# EAGLE design schematic (EAGLE 8.3.1)
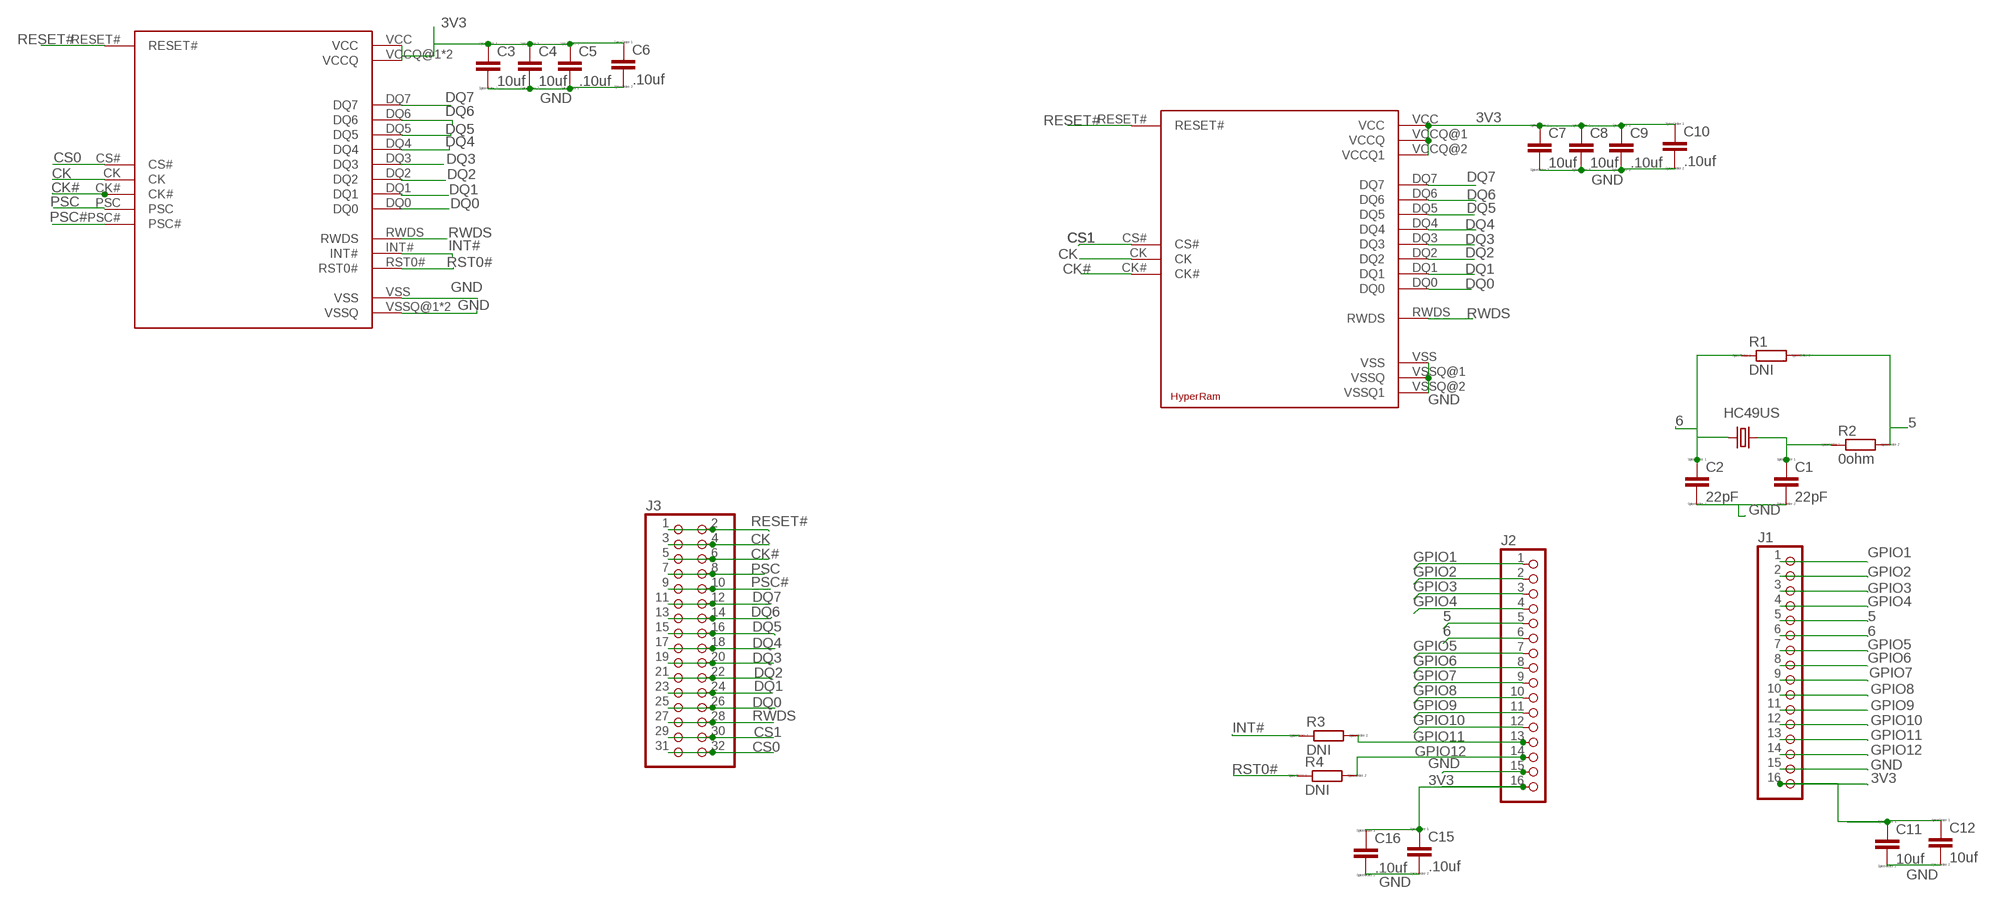
[diagram p0: schematic, sheet 1]

## Parts
C1  22pF  CC0603  [C0603]
C2  22pF  CC0603  [C0603]
C3  10uf  CC0402  [C0402]
C4  10uf  CC0402  [C0402]
C5  .10uf  CC0402  [C0402]
C6  .10uf  CC0402  [C0402]
C7  10uf  CC0402  [C0402]
C8  10uf  CC0402  [C0402]
C9  .10uf  CC0402  [C0402]
C10  .10uf  CC0402  [C0402]
C11  10uf  CC0402  [C0402]
C12  10uf  CC0402  [C0402]
C15  .10uf  CC0402  [C0402]
C16  .10uf  CC0402  [C0402]
HC49US  12 Mhz  MODIFIEDSMD  [HC49UP]
J1  PINHD-1X16  [1X16]
J2  PINHD-1X16  [1X16]
J3  PINHD-2X16  [2X16]
R1  DNI  RR0603  [R0603]
R2  0ohm  RR0603  [R0603]
R3  DNI  RR0603  [R0603]
R4  DNI  RR0603  [R0603]
U$1  HYPERFLASH_MEMORY  [BGA-24]
U$2  HYPERFLASH_MEMORY  [BGA-24_RAM]

## Nets
3V3: C3.1 C4.1 C5.1 C6.1 C7.1 C8.1 C9.1 C10.1 C11.1 C12.1 C15.1 C16.1 J1.16 J2.16 U$1.VCC U$1.VCCQ@1(VCCQ) U$1.VCCQ@2(VCCQ) U$2.VCC U$2.VCCQ@1(VCCQ) U$2.VCCQ@2(VCCQ1)
5: J1.5 J2.5 R1.2 R2.2
6: C2.1 HC49US.1 HC49US.P$1 J1.6 J2.6 R1.1
CK: J3.3 J3.4 U$1.CK U$2.CK
CK#: J3.5 J3.6 U$1.CK# U$2.CK#
CS0: J3.31 J3.32 U$1.CS#
CS1: J3.29 J3.30 U$2.CS#
DQ0: J3.25 J3.26 U$1.DQ0 U$2.DQ0
DQ1: J3.23 J3.24 U$1.DQ1 U$2.DQ1
DQ2: J3.21 J3.22 U$1.DQ2 U$2.DQ2
DQ3: J3.19 J3.20 U$1.DQ3 U$2.DQ3
DQ4: J3.17 J3.18 U$1.DQ4 U$2.DQ4
DQ5: J3.15 J3.16 U$1.DQ5 U$2.DQ5
DQ6: J3.13 J3.14 U$1.DQ6 U$2.DQ6
DQ7: J3.11 J3.12 U$1.DQ7 U$2.DQ7
GND: C1.2 C2.2 C3.2 C4.2 C5.2 C6.2 C7.2 C8.2 C9.2 C10.2 C11.2 C12.2 C15.2 C16.2 J1.15 J2.15 U$1.VSS U$1.VSSQ@1(VSSQ) U$1.VSSQ@2(VSSQ) U$2.VSS U$2.VSSQ@1(VSSQ) U$2.VSSQ@2(VSSQ1)
GPIO1: J1.1 J2.1
GPIO2: J1.2 J2.2
GPIO3: J1.3 J2.3
GPIO4: J1.4 J2.4
GPIO5: J1.7 J2.7
GPIO6: J1.8 J2.8
GPIO7: J1.9 J2.9
GPIO8: J1.10 J2.10
GPIO9: J1.11 J2.11
GPIO10: J1.12 J2.12
GPIO11: J1.13 J2.13 R3.2
GPIO12: J1.14 J2.14 R4.2
INT#: R3.1 U$1.INT#
N$7: C1.1 HC49US.2 HC49US.P$2 R2.1
PSC: J3.7 J3.8 U$1.PSC
PSC#: J3.9 J3.10 U$1.PSC#
RESET#: J3.1 J3.2 U$1.RESET# U$2.RESET#
RST0#: R4.1 U$1.RST0#
RWDS: J3.27 J3.28 U$1.RWDS U$2.RWDS

## Library data of the parts
C1-C12 C15 C16 = eagle-ltspice:C: CAPACITOR, European symbol; SPICEMODEL: NONE; SPICEPREFIX: C
HC49US = modifiedsmd:MODIFIEDSMD
J1 J2 = pinhead:PINHD-1X16: PIN HEADER
J3 = pinhead:PINHD-2X16: PIN HEADER
R1-R4 = eagle-ltspice:R: RESISTOR, European symbol; SPICEMODEL: NONE; SPICEPREFIX: R
U$1 = hyperflash:HYPERFLASH_MEMORY
U$2 = hyper_ram:HYPERFLASH_MEMORY

## Board
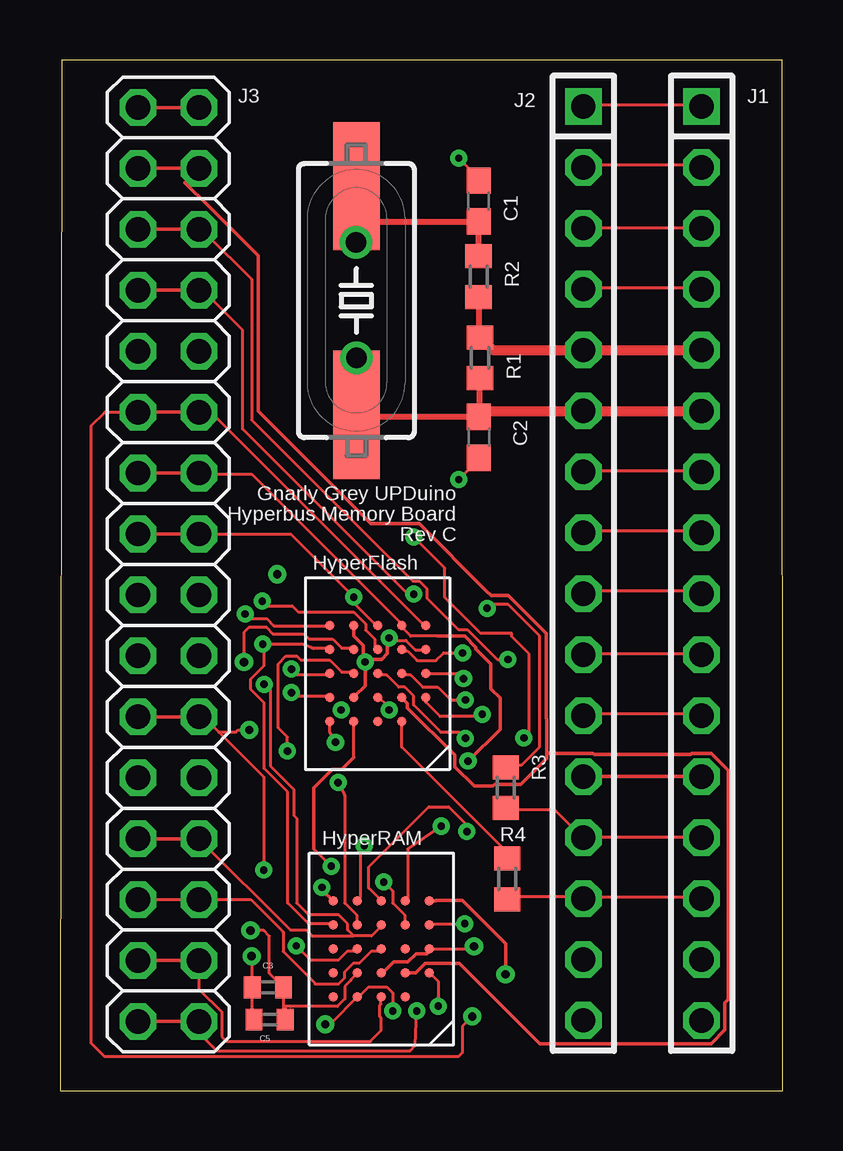
[diagram p1: board, top side]
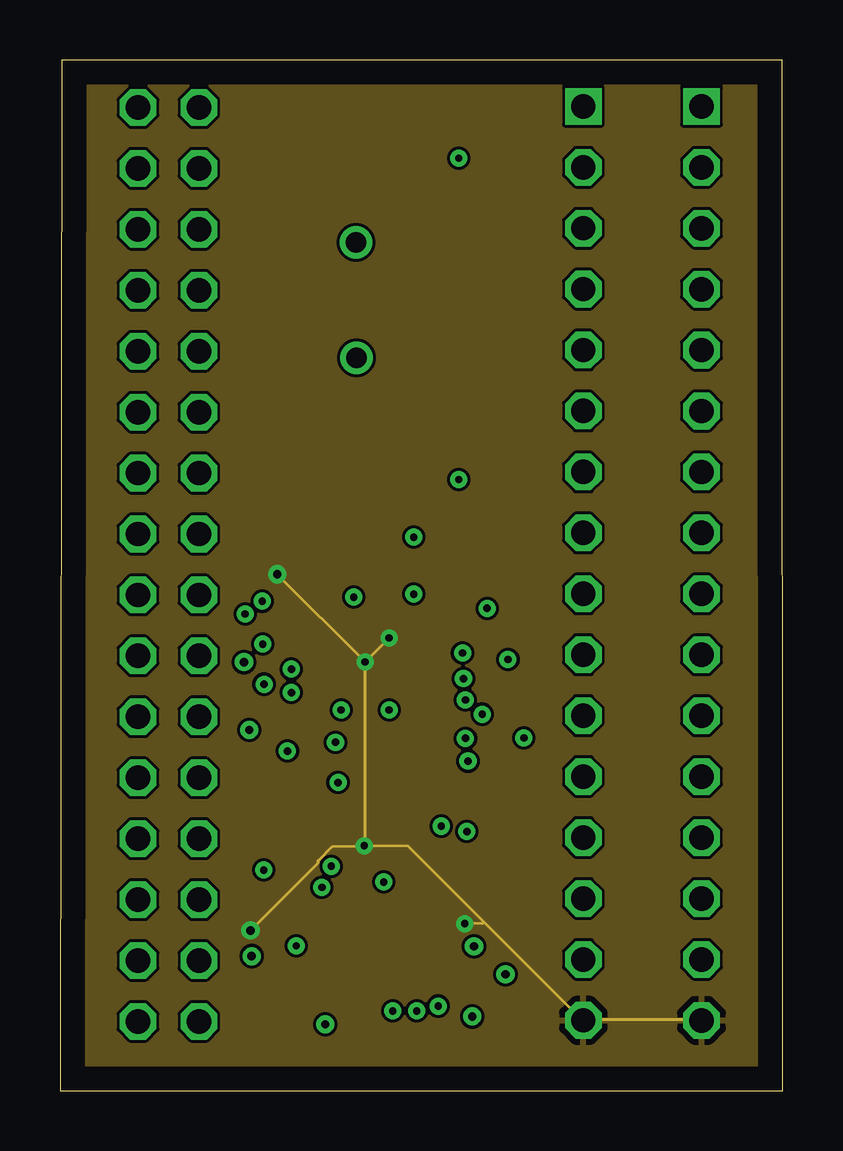
[diagram p2: board, inner layer 3V3]
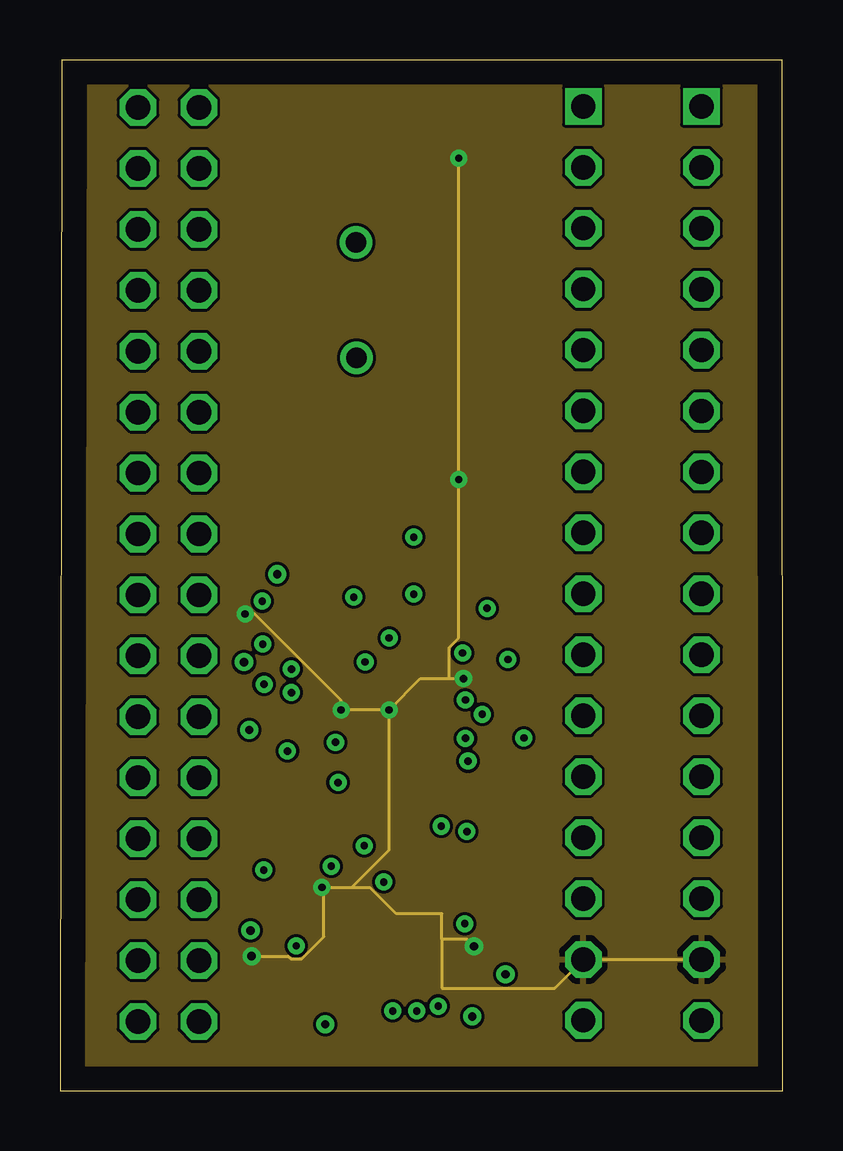
[diagram p3: board, inner layer GND]
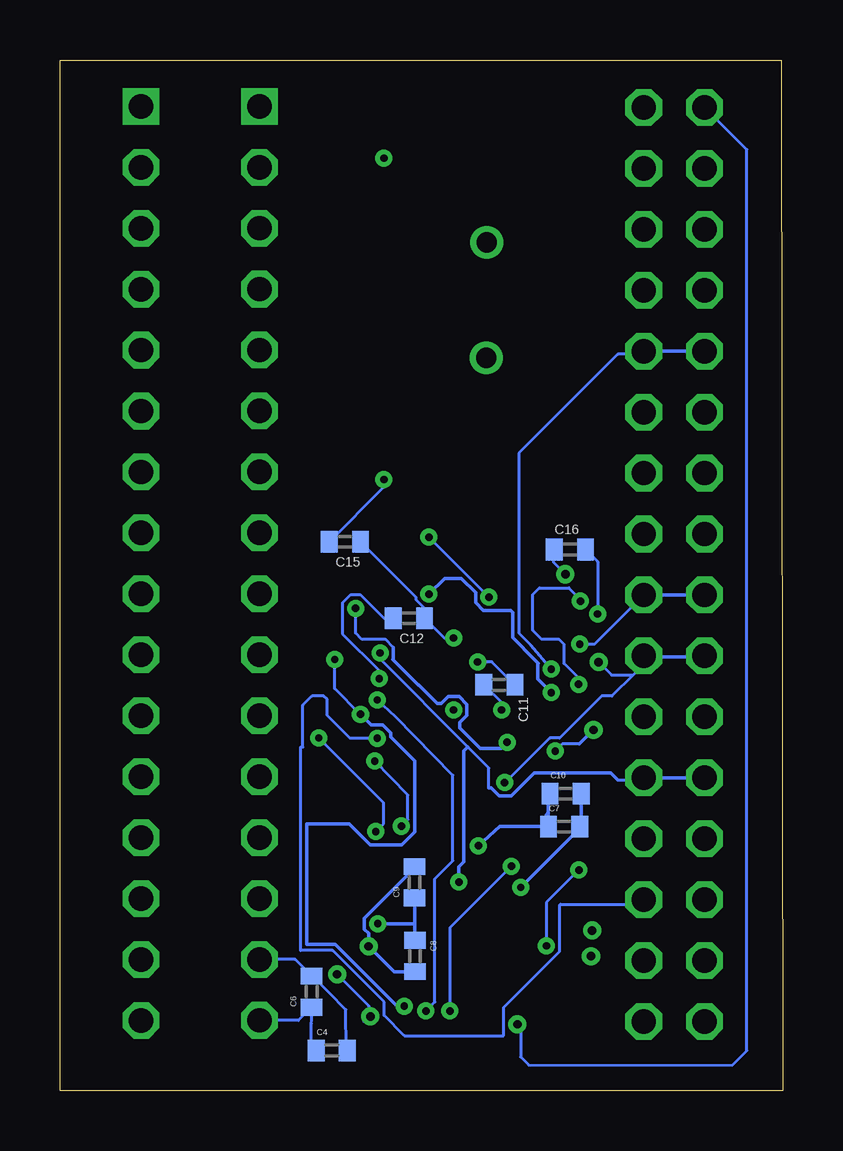
[diagram p4: board, bottom side, seen from below]

Size 30.11 x 42.98 mm. Coordinates in mm from the lower left corner, seen from the top.
Outline: 0,0 30.11,0 30.09,42.97 0.06,42.98 0,0
Copper layers (1*2+15*16): Top 0.035mm / dielectric 1.5mm / 3V3 0.035mm / dielectric 0.15mm / GND 0.035mm / dielectric 0.2mm / Bottom 0.035mm
Design rules "default *": minimum track width 5mil, minimum drill 12mil, track to track 5mil, track to pad 5mil, pad to pad 5mil, via to via 5mil, smd to smd 5mil, copper to edge 40mil, drill to drill 6mil, minimum pad ring 10mil, minimum via ring 8mil, stop-mask expansion 4mil, vias tented up to drill 0mil, thermal gap 10mil

### Footprints (pad centres in the part's own frame; a part is rotated, then mirrored left to right if it is on the bottom)
C0603 = smd 1.1 x 1: 1 -0.85,0; 2 0.85,0
C0402 = smd 0.7 x 0.9: 1 -0.65,0; 2 0.65,0
HC49UP = smd 5.334 x 1.93: 1 -4.763,0; 2 4.763,0 | drill 0.85: P$1 -2.393,-0.001; P$2 2.426,0.022
1X16 = drill 1.016 square: 1 -19.05,0 | drill 1.016 octagon: 2 -16.51,0; 3 -13.97,0; 4 -11.43,0; 5 -8.89,0; 6 -6.35,0; 7 -3.81,0; 8 -1.27,0; 9 1.27,0; 10 3.81,0; 11 6.35,0; 12 8.89,0; 13 11.43,0; 14 13.97,0; 15 16.51,0; 16 19.05,0
2X16 = drill 1.016 octagon: 1 -19.05,-1.27; 2 -19.05,1.27; 3 -16.51,-1.27; 4 -16.51,1.27; 5 -13.97,-1.27; 6 -13.97,1.27; 7 -11.43,-1.27; 8 -11.43,1.27; 9 -8.89,-1.27; 10 -8.89,1.27; 11 -6.35,-1.27; 12 -6.35,1.27; 13 -3.81,-1.27; 14 -3.81,1.27; 15 -1.27,-1.27; 16 -1.27,1.27; 17 1.27,-1.27; 18 1.27,1.27; 19 3.81,-1.27; 20 3.81,1.27; 21 6.35,-1.27; 22 6.35,1.27; 23 8.89,-1.27; 24 8.89,1.27; 25 11.43,-1.27; 26 11.43,1.27; 27 13.97,-1.27; 28 13.97,1.27; 29 16.51,-1.27; 30 16.51,1.27; 31 19.05,-1.27; 32 19.05,1.27
R0603 = smd 1 x 1.1: 1 -0.85,0; 2 0.85,0
BGA-24 = smd 0.4 x 0.4: CK -1.07,1.016; CK# -2.07,1.016; CS# -1.07,0.016; DNU -0.07,2.016; DQ0 -0.07,-0.984; DQ1 -1.07,-0.984; DQ2 0.93,0.016; DQ3 0.93,-0.984; DQ4 1.93,-0.984; DQ5 -0.07,-1.984; DQ6 -1.07,-1.984; DQ7 -2.07,-1.984; INT# 1.93,2.016; PSC 1.93,1.016; PSC# 1.93,0.016; RESET# 0.93,2.016; RST0# -1.07,2.016; RWDS -0.07,0.016; VCC 0.93,1.016; VCCQ@1 -2.07,-0.984; VCCQ@2 0.93,-1.984; VSS -0.07,1.016; VSSQ@1 -2.07,0.016; VSSQ@2 1.93,-1.984
BGA-24_RAM = smd 0.4 x 0.4: CK -1.07,1.016; CK# -2.07,1.016; CS# -0.07,2.016; DQ0 -0.07,-0.984; DQ1 -1.07,-0.984; DQ2 0.93,0.016; DQ3 0.93,-0.984; DQ4 1.93,-0.984; DQ5 -0.07,-1.984; DQ6 -1.07,-1.984; DQ7 -2.07,-1.984; RESET# 0.93,2.016; RFU@1 -1.07,2.016; RFU@2 -1.07,0.016; RFU@3 1.93,2.016; RFU@4 1.93,1.016; RFU@5 1.93,0.016; RWDS -0.07,0.016; VCC 0.93,1.016; VCCQ@1 -2.07,-0.984; VCCQ@2 0.93,-1.984; VSS -0.07,1.016; VSSQ@1 -2.07,0.016; VSSQ@2 1.93,-1.984

### Placement (x,y rotation side)
C1  17.45,37.1 90 top
C2  17.44,27.25 270 top
C3  8.66,4.32 180 top
C4  18.79,1.69 0 bottom
C5  8.73,2.98 180 top
C6  19.63,4.14 90 bottom
C7  9.11,11.02 0 bottom
C8  15.32,5.62 270 bottom
C9  15.34,8.7 90 bottom
C10  9.04,12.4 0 bottom
C11  11.8,16.93 180 bottom
C12  15.57,19.7 180 bottom
C15  18.24,22.89 180 bottom
C16  8.86,22.57 0 bottom
HC49US  12.35,32.95 90 top
J1  26.73,21.99 270 top
J2  21.8,21.99 270 top
J3  4.52,21.95 270 top
R1  17.5,30.56 90 top
R2  17.44,33.95 270 top
R3  18.57,12.64 270 top
R4  18.63,8.84 270 top
U$1  13.16,17.41 180 top
U$2  13.32,5.93 180 top

### Tracks (layer width: path | path; a pad name or v marks a point on that pad's centre or on a via)
3V3  (via drill 0.3, 0.35)
  Top 0.127: U$2.VCCQ@2 12.41,7.99 12.51,8.09 12.51,10.06 v12.68,10.22 | U$1.VCC 12.31,16.49 | U$1.VCCQ@2 12.31,19.39 U$1.VCCQ@2 | v13.71,18.89 13.81,18.79 14.41,18.79 14.81,18.39 15.21,18.39 U$1.VCCQ@1 | v16.87,6.97 15.43,6.96 15.43,6.95 U$2.VCCQ@1 | U$2.VCC 12.12,4.64 12.12,4.61 11.87,4.36 11.87,3.84 11.56,3.53 9.62,3.53 | 9.62,3.53 9.61,3.52 | 9.62,3.53 9.38,3.53 C5.1 9.31,2.98 C3.1 8.73,4.91 8.73,6.45 8.49,6.69 v7.94,6.69
  Top 0.15: 12.61,10.16 v12.68,10.22 | 12.31,16.49 12.71,16.89 12.71,17.81 | 12.71,17.81 v12.71,17.89 | v13.71,18.89 13.63,18.81 13.63,18.23 13.4,17.99 12.89,17.99 12.78,17.88 | 12.78,17.88 12.71,17.81 | U$1.VCCQ@2 12.23,18.96 12.63,18.56 12.63,18.03 12.78,17.88
  3V3 0.127: v12.68,10.22 14.51,10.19 17.61,7.09 | 17.61,7.09 21.71,2.99 J2.16 21.81,2.99 26.71,2.99 J1.16 | 12.71,16.89 v12.71,17.89 | v12.71,17.89 v13.71,18.89 | v16.87,6.97 17.61,6.99 17.61,7.09 | v7.94,6.69 10.76,9.51 10.76,9.59 11.35,10.19 v12.68,10.22 | v12.68,10.22 12.71,10.26 v12.71,17.89 | v12.71,17.89 v9.06,21.54 v9.05,21.54
  Bottom 0.127: C4.1 19.63,1.53 19.63,2.81 19.63,2.93 C6.1 20.17,2.94 J2.16 | C11.1 12.11,17.89 v12.71,17.89 | C12.1 | C12.1 14.11,18.89 v13.71,18.89 | C15.1 15.28,20.58 15.28,20.48 14.92,20.12 C12.1 | v9.05,21.54 9.54,22.02 C16.1
  Bottom 0.15: C8.1 15.32,8.03 C9.1 15.34,6.97 v16.87,6.97 | 9.76,11.6 C7.1 11.78,11.02 v12.68,10.22 | 9.76,11.6 9.76,12.33 C10.1 | 9.85,11.51 9.76,11.6
  pour 3V3: 0.51,42.49 29.51,42.49 29.44,0.2 0.63,0.16
5
  Top 0.2: 17.44,31.66 17.44,31.47 R1.2
  Top 0.254: 17.44,32.72 17.44,31.66
  Top 0.305: R2.2 17.44,32.72
  Top 0.406: R1.2 18.03,30.88 J2.5 J1.5
6
  Top 0.254: R1.1 17.5,28.15 C2.1 12.98,28.1 HC49US.1 12.93,30.42 HC49US.P$1
  Top 0.406: C2.1 17.69,28.34 J2.6 J1.6
CK
  Top 0.152: J3.3 J3.4 5.2,37.87 6.19,36.88 8.25,34.82 8.25,28.34 12.95,23.64 14.97,23.64 17.76,20.85 17.97,20.65 18.68,20.65 20.25,19.07 20.25,15.52 20.29,15.49 20.29,14.08 | 20.29,14.08 20.29,13.87 19.21,12.79 18.11,12.79 18.03,12.71 17.25,12.71 16.44,13.52 16.44,14.01 14.47,15.98 14.47,16.15 U$1.CK | U$2.CK 14.83,4.92 15.23,5.32 16.64,5.32 19.98,1.98 27.13,1.98 27.7,2.54 27.7,3.68 27.84,3.82 27.84,13.35 27.13,14.07 26.33,14.07 26.28,14.02 22.26,14.02 22.2,14.07 20.3,14.07 20.29,14.08
CK#  (via drill 0.3)
  Top 0.127: 5.99,35.84 6.12,35.7 7.99,33.84 7.99,27.97 14.71,21.26 14.96,21.26 15.28,20.94 15.28,20.54 16.6,19.23 16.97,19.23 18.21,17.99 v18.67,17.99 | U$1.CK# 15.24,16.34 15.24,16.21 15.84,15.61 17.5,15.61 v17.59,15.7 | U$2.CK# 15.49,4.84 15.76,4.56 v15.76,3.54
  Top 0.152: J3.5 J3.6 5.91,35.92 6.12,35.7
  Bottom 0.127: v17.59,15.7 18.67,16.78 v18.67,17.99
  Bottom 0.15: 17.85,5.33 18.64,6.12 19.82,6.12 19.82,11.14 18.07,11.14 17.94,11.01 17.51,10.58 17.18,10.26 15.88,10.26 15.33,10.81 15.33,11.54 15.32,11.55
  Bottom 0.152: v15.76,3.54 16.06,3.54 17.85,5.33 | 15.33,10.81 15.33,11.16 15.32,11.16 15.32,11.55 15.32,13.75 16.34,14.77 16.34,14.93 16.66,15.26 17.15,15.26 v17.59,15.7
CS0  (via drill 0.3)
  Top 0.127: v14.86,3.34 14.81,1.9 14.59,1.68 6.53,1.68 5.79,2.43 J3.32 | U$1.CS# 14.24,17.34 14.61,17.34 15.11,16.84 15.74,16.84 16.28,16.3 v16.89,16.3
  Top 0.152: J3.31 J3.32 5.97,2.71
  Bottom 0.127: v16.89,16.3 16.11,15.59 13.74,13.16 13.74,9.59 14.49,8.84 14.49,3.71 v14.86,3.34
CS1
  Top 0.127: 13.37,3.85 13.36,3.84 | 13.37,3.85 U$2.CS# | J3.30 5.79,4.24 6.74,3.29 6.74,2.26 6.94,2.06 12.93,2.06 13.38,2.52 13.38,3.04 13.32,3.11 13.32,3.56 13.37,3.62 13.37,3.85
  Top 0.152: J3.29 J3.30 5.89,5.34 5.99,5.34
DQ0  (via drill 0.3)
  Top 0.127: 12.24,6.46 11.99,6.71 11.99,6.96 11.61,7.34 10.36,7.34 9.86,7.84 9.86,11.36 9.74,11.48 9.74,12.57 8.82,13.49 8.76,13.54 8.76,16.69 v8.5,16.95 | 12.24,6.46 12.99,6.46 13.36,6.84 U$2.DQ0 | U$1.DQ0 13.11,18.46 13.11,18.84 12.74,19.21 12.74,19.46 12.24,19.96 9.93,19.96 9.67,20.22 8.62,20.22 v8.43,20.41 | 6.03,10.42 5.99,10.46 | J3.26 9.6,6.71 10.26,6.71 10.5,6.46 12.24,6.46
  Top 0.152: J3.25 J3.26 5.88,10.42 6.03,10.42
  Bottom 0.127: v8.5,16.95 8.5,17.21 9.1,17.81 9.1,18.62 9.31,18.83 10.04,18.83 10.4,19.19 10.4,20.7 10.13,20.97 8.9,20.97 8.43,20.49 v8.43,20.41
DQ1  (via drill 0.3)
  Top 0.127: v13.49,8.71 13.86,8.34 13.86,7.84 14.36,7.34 14.36,6.96 U$2.DQ1 | U$1.DQ1 14.24,18.34 14.49,18.34 14.88,17.94 15.67,17.94 15.98,18.26 v16.77,18.26
  Bottom 0.127: 6.86,12.96 5.99,12.96 | 12.24,12.63 12.24,13.46 13.12,14.35 16.77,18 v16.77,18.26
  Bottom 0.15: 12.24,12.63 12.15,12.63 11.82,12.3 11.31,12.3 10.35,13.26 7.16,13.26 6.86,12.96 | v13.49,8.71 13.49,9.34 13.29,9.54 13.29,14.18 13.12,14.35
  Bottom 0.152: J3.23 J3.24 5.88,12.96 5.99,12.96
DQ2  (via drill 0.3, 0.35)
  Top 0.127: v8.49,9.21 8.49,13.09 6.61,14.96 | 6.61,14.96 5.99,15.59 | U$2.DQ2 12.36,5.84 11.99,5.84 11.61,5.46 10.43,5.46 v9.84,6.04 | U$1.DQ2 12.11,17.46 11.74,17.46 11.24,17.96 10.04,17.96 9.87,18.13 9.42,18.13 9.1,17.81 9.1,15.14 9.48,14.76 v9.48,14.17 | 6.61,14.96 7.33,14.96 7.42,15.05 7.86,15.05
  Top 0.152: J3.21 J3.22 5.99,15.59 | 7.86,15.05 v7.88,15.05
  Bottom 0.127: v8.49,9.21 9.84,7.86 v9.84,6.04 | 8.47,14.46 9.18,14.46 v9.48,14.17
  Bottom 0.152: J3.22 | v7.88,15.05 8.47,14.46
DQ3  (via drill 0.3, 0.35)
  Top 0.127: v11.59,12.86 11.86,12.31 11.86,7.84 12.36,7.34 12.36,6.96 U$2.DQ3 | U$1.DQ3 12.11,18.46 11.74,18.46 11.36,18.84 10.39,18.84 10.17,19.06 8.87,19.06 8.59,19.33 7.88,19.33 7.68,19.13 7.68,17.88 v7.67,17.88
  Bottom 0.127: 5.49,18.09 6.23,17.34 | v7.67,17.88 7.13,17.34 6.23,17.34 | v11.59,12.86 11.43,12.99 9.7,14.71 9.29,14.71 7.55,16.46 7.12,16.46 6.23,17.34
  Bottom 0.152: J3.19 3.3,18.09 5.49,18.09 5.74,18.09 J3.20
DQ4  (via drill 0.3)
  Top 0.127: 11.11,18.34 U$1.DQ4 11.19,18.44 10.56,18.44 10.51,18.46 10.05,18.63 8.51,18.63 | U$2.DQ4 11.36,6.96 10.36,6.96 9.49,7.84 9.49,12.46 8.51,13.44 8.51,16.17 7.96,16.73 7.96,17.18 8.51,17.73 8.51,18.63 | 8.51,18.63 v8.45,18.63
  Bottom 0.127: 8.45,18.64 v8.45,18.63 8.44,18.64 7.83,18.64 J3.18
  Bottom 0.152: J3.17 J3.18 5.9,20.68 5.99,20.59
DQ5  (via drill 0.3)
  Top 0.127: U$2.DQ5 13.36,7.96 12.86,8.46 12.86,9.34 15.37,11.84 16.2,11.84 16.95,11.09 v16.95,10.81 | U$1.DQ5 13.11,19.46 12.24,20.34 v12.24,20.59 9.61,23.21 5.99,23.21 | v14.74,23.09 16.03,21.79 16.03,20.57 17.53,19.08 18.81,19.08 18.81,18.94 19.54,18.21 19.54,14.93 v19.33,14.71
  Top 0.152: J3.15 J3.16 5.98,23.22 5.99,23.21
  Bottom 0.127: v19.33,14.71 16.63,12.01 16.63,11.14 v16.95,10.81 | v12.24,20.59 v14.74,23.09
DQ6  (via drill 0.3)
  Top 0.127: v15.89,11.04 14.49,10.09 14.49,7.96 U$2.DQ6 | 15.74,18.96 14.61,18.96 14.24,19.34 U$1.DQ6 14.24,19.46 7.99,25.71 6.07,25.71 5.99,25.71
  Top 0.15: v17,13.75 v17.01,13.75 18.34,15.08 18.34,16.38 17.96,16.76 17.96,17.8 17.33,18.42 17.33,18.49 16.86,18.96 15.74,18.96
  Top 0.152: J3.13 J3.14 6.03,25.76 6.07,25.71
  Bottom 0.127: v17,13.75 15.61,12.34 15.61,11.31 v15.89,11.04
DQ7  (via drill 0.35)
  Top 0.127: 5.99,28.21 6.36,28.21 15.11,19.46 U$1.DQ7 | 18.59,4.87 18.57,4.86 v18.56,4.86 | v17.18,3.11 16.77,2.69 16.77,1.6 16.59,1.42 1.86,1.42 1.31,1.98 1.31,27.74 1.86,28.29
  Top 0.152: 3.33,28.3 J3.11 | 3.33,28.3 J3.12 5.9,28.3 5.99,28.21 | 1.86,28.29 3.33,28.3 | U$2.DQ7 15.65,7.92 15.68,7.94 16.75,7.94 18.56,6.13 v18.56,4.86
  Bottom 0.127: 17.25,3.11 17.45,2.9 | 17.25,3.11 v17.18,3.11 | 17.25,3.11 17.25,3.54 v18.56,4.86
GND  (via drill 0.3, 0.35)
  Top 0.127: U$2.VSS 13.41,4.89 | 10.91,8.39 v10.91,8.49 | v13.71,15.89 13.61,15.99 13.61,16.09 13.31,16.39 U$1.VSS | v16.81,17.19 16.61,17.39 15.31,17.39 U$1.VSSQ@1 | v7.71,19.89 7.91,19.69 8.61,19.69 8.91,19.39 11.21,19.39 U$1.VSSQ@2 | v16.61,25.49 17.41,26.29 17.41,26.39 C2.2 | v16.61,38.89 17.41,38.09 17.41,37.99 C1.2 | U$2.VSSQ@1 15.47,5.92 16.86,5.92 16.88,5.94 17.16,5.94 v17.25,6.03 | C5.2 8.01,2.98 C3.2 8.01,5.71 7.99,5.71 v7.99,5.62
  Top 0.15: 13.41,4.89 13.91,5.38 14.5,5.38 14.84,5.72 15.28,5.72 15.47,5.92
  Top 0.152: U$2.VSSQ@2 11.38,7.92 10.91,8.39
  GND 0.127: 15.91,6.33 15.91,7.39 14.01,7.39 12.91,8.49 12.16,8.49 | 15.91,6.33 15.91,4.29 20.61,4.29 21.71,5.39 J2.15 26.71,5.49 J1.15 | v13.71,15.89 v11.71,15.89 11.71,16.29 8.11,19.89 v7.71,19.89 | 10.99,8.49 v10.91,8.49 | 10.99,8.49 12.16,8.49 | 16.21,17.19 15.01,17.19 v13.71,15.89 | 16.21,17.19 v16.81,17.19 | 16.21,17.19 16.21,18.49 16.61,18.89 v16.61,25.49 v16.61,38.89 | v17.25,6.03 16.95,6.33 15.91,6.33 | v7.99,5.62 9.5,5.62 9.62,5.5 10.07,5.5 10.99,6.42 10.99,8.49 | 12.16,8.49 13.71,10.04 v13.71,15.89
  Bottom 0.127: J2.15 20.32,5.48 C6.2 19.59,4.79 18.2,3.39 18.19,1.72 C4.2 | C11.2 11.71,16.18 v11.71,15.89 | v16.81,17.19 16.81,17.52 18.34,19.05 18.34,20.34 18.02,20.66 17.57,20.66 16.61,19.7 C12.2 | C15.2 16.61,25.16 v16.61,25.49 | C16.2 7.71,22.07 v7.71,19.89
  Bottom 0.15: C8.2 16.19,4.97 v17.25,6.03 17.25,6.56 17.43,6.74 17.43,7.2 15.34,9.29 C9.2 | C10.2 8.39,11.09 C7.2 8.46,10.94 v10.91,8.49
  pour GND: 0.61,42.49 29.41,42.49 29.45,0.24 0.61,0.2
GPIO1
  Top 0.127: J2.1 21.86,41.09 26.61,41.09 J1.1
GPIO2
  Top 0.127: J2.2 21.86,38.59 26.61,38.59 J1.2
GPIO3
  Top 0.127: J2.3 21.86,35.96 26.61,35.96 J1.3
GPIO4
  Top 0.127: J2.4 21.86,33.46 26.61,33.46 J1.4
GPIO5
  Top 0.127: J2.7 21.86,25.84 26.61,25.84 J1.7
GPIO6
  Top 0.127: J2.8 21.86,23.34 26.61,23.34 J1.8
GPIO7
  Top 0.127: J2.9 21.86,20.84 26.61,20.84 J1.9
GPIO8
  Top 0.127: J2.10 21.86,18.21 26.61,18.21 J1.10
GPIO9
  Top 0.127: J2.11 21.86,15.71 26.61,15.71 J1.11
GPIO10
  Top 0.152: J2.12 J1.12
GPIO11
  Top 0.127: R3.2 18.61,11.71 20.61,11.71 21.74,10.59 J2.13 21.86,10.59 26.61,10.59 J1.13
GPIO12
  Top 0.127: R4.2 18.74,8.09 21.74,8.09 J2.14 21.86,8.09 26.61,8.09 J1.14
INT#  (via drill 0.3)
  Top 0.127: v11.48,14.53 11.24,14.96 11.24,15.34 U$1.INT# | R3.1 18.61,13.59 19.24,13.59 19.99,14.34 19.99,18.96 18.65,20.3 17.9,20.3 17.9,20.22 v17.8,20.12
  Bottom 0.127: 16.22,18.49 16.55,18.82 17.53,18.82 17.8,19.08 v17.8,20.12
  Bottom 0.15: 16.22,18.49 16.22,18.03 16.25,17.99 15.18,16.92 15.16,16.92 14.4,16.16 14.23,16.16 13.94,16.44 13.48,16.44 13.15,16.12 13.15,15.65 13.45,15.36 13.45,15.14 12.59,14.28 11.73,14.28 v11.48,14.53
N$7
  Top 0.2: 17.44,36.05 C1.1
  Top 0.254: R2.1 17.44,36.05 | HC49US.P$2 12.93,35.26 HC49US.2 12.93,36.25 C1.1
PSC  (via drill 0.3)
  Top 0.127: 5.99,33.34 7.61,31.71 7.61,27.58 14.48,20.71 v14.74,20.71 | U$1.PSC 11.11,16.46 9.79,16.46 v9.64,16.61
  Top 0.152: J3.7 J3.8 5.95,33.38 5.99,33.34
  Bottom 0.15: v9.64,16.61 10.2,17.16 10.2,17.81 10.19,17.82 10.32,17.98 11.25,18.91 11.25,19.94 11.34,20.03 12.47,20.03 12.8,20.35 12.8,20.77 13.39,21.36 14.09,21.36 v14.74,20.71
PSC#  (via drill 0.3)
  Top 0.127: 11.16,17.36 11.11,17.34 | 11.16,17.36 U$1.PSC# | v9.64,17.58 9.87,17.36 11.16,17.36
  Bottom 0.127: v9.64,17.58 10.49,18.59 10.99,19.09 10.99,26.59 6.86,30.71 6.02,30.71 5.99,30.71
  Bottom 0.152: J3.9 J3.10 5.89,30.84 6.02,30.71
RESET#  (via drill 0.3, 0.35)
  Top 0.127: v13.86,3.34 13.86,4.09 13.61,4.34 12.86,4.34 12.49,3.96 U$2.RESET# 11.27,2.8 11.16,2.8 11.15,2.78 v11.05,2.78 | 12.11,15.34 U$1.RESET# 12.23,13.9 12.05,13.72 | v11.3,9.37 10.58,10.09
  Top 0.15: 12.23,13.9 11.75,13.41 11.35,13.41 10.58,12.64 10.58,10.09
  Top 0.152: J3.2 J3.1
  Bottom 0.127: v11.3,9.37 13.86,6.81 v13.86,3.34 | J3.1 1.49,39.24 1.49,1.68 2.09,1.08 10.58,1.08 10.92,1.42 10.92,2.65 v11.05,2.78
RST0#
  Top 0.127: U$1.RST0# 14.24,15.34 14.24,14.34 18.61,9.96 18.61,9.71 R4.1
RWDS  (via drill 0.3)
  Top 0.127: 6,7.94 5.99,7.96 | U$2.RWDS 13.36,5.84 12.99,5.84 12.49,5.34 12.24,5.34 11.86,4.96 11.86,4.71 11.61,4.46 10.62,4.46 10.62,4.5 9.3,5.82 9.3,6.63 7.95,7.98 J3.28 | U$1.RWDS 13.24,17.34 13.61,17.34 14.11,16.84 14.36,16.84 14.74,16.46 14.74,16.09 15.86,14.96 16.63,14.96 v16.89,14.7
  Top 0.152: J3.27 5.99,7.96 J3.28
  Bottom 0.127: v16.89,14.7 18.02,14.7 18.98,15.66 18.98,16.33 19.11,16.46 19.61,16.46 19.99,16.09 19.99,14.34 20.09,14.34 20.09,5.85 18.75,5.85 16.61,3.71 16.61,3.15 15.76,2.3 11.63,2.3 11.63,3.48 9.3,5.82 9.3,7.75 9.26,7.79 5.98,7.79 J3.28

### Text on the board
tNames: Gnarly Grey UPDuino / Hyperbus Memory Board / Rev C